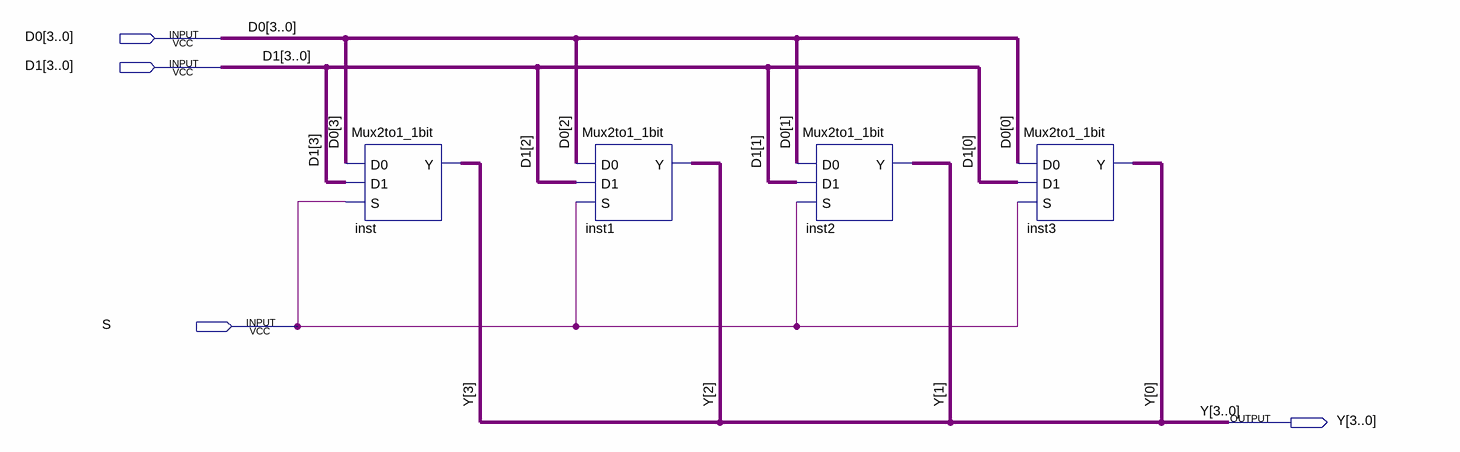
[diagram p0: schematic sheet]
// Quartus schematic Mux2to1_4bit.bdf as structural Verilog: 4 symbols, 4 pins
module Mux2to1_4bit (
  input  [3:0] D0,
  input  [3:0] D1,
  input  S,
  output [3:0] Y
);

  Mux2to1_1bit inst (.D0(D0[3]), .D1(D1[3]), .S(S), .Y(Y[3]));
  Mux2to1_1bit inst1 (.D0(D0[2]), .D1(D1[2]), .S(S), .Y(Y[2]));
  Mux2to1_1bit inst2 (.D0(D0[1]), .D1(D1[1]), .S(S), .Y(Y[1]));
  Mux2to1_1bit inst3 (.D0(D0[0]), .D1(D1[0]), .S(S), .Y(Y[0]));
endmodule
